# Altium project CW521_BallisticGel.PrjPcb
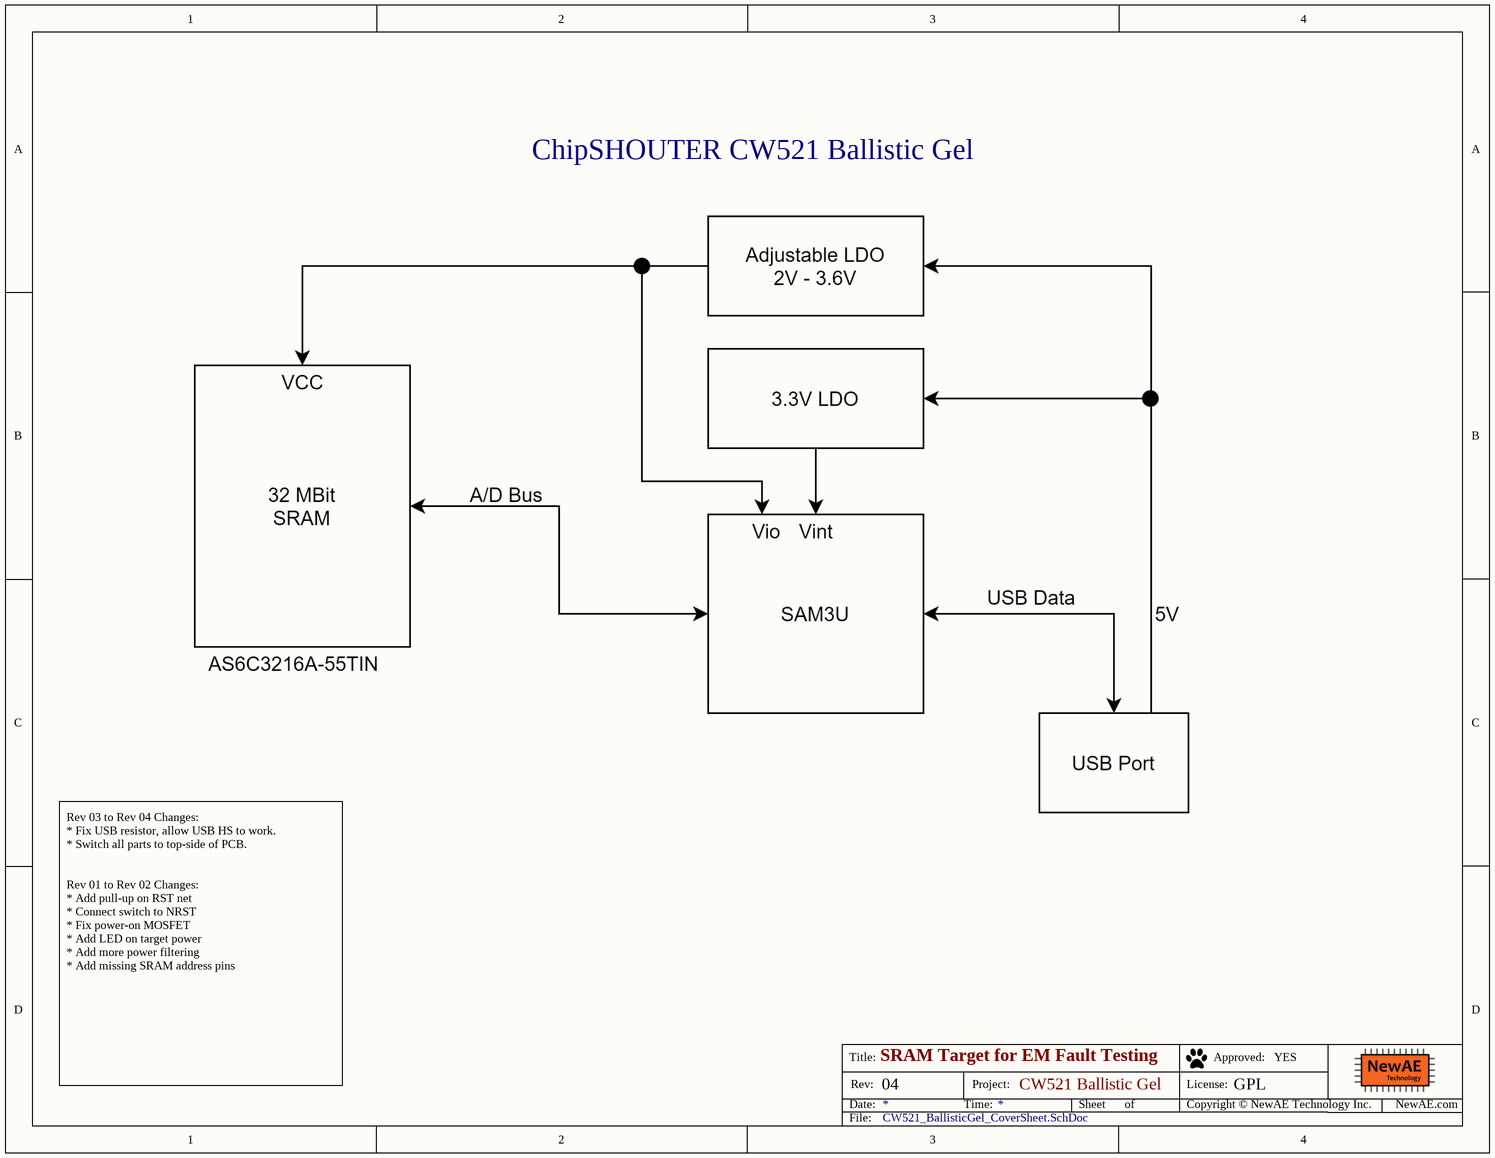
[diagram p0: CW521_BallisticGel_CoverSheet.SchDoc]
PrjLicense: GPL; PrjName: CW521 Ballistic Gel; PrjRev: 04
3 sheets, 102 parts. Net scope: flat (ports and power ports of the same name join across sheets).
Board files: CW521_BallisticGel.PcbDoc, CW521_BallisticGel_PANEL.PcbDoc
Sheets:
  CW521_BallisticGel_CoverSheet.SchDoc
  CW521_BallisticGel_Connectors.SchDoc
  CW521_BallisticGel_Main.SchDoc

## Sheet CW521_BallisticGel_CoverSheet.SchDoc: SRAM Target for EM Fault Testing
size Letter; Organization: NewAE Technology Inc.; Address1: 1083 Queen St., Suite 196; Address2: Halifax; Address3: NS; Address4: Canada B3H 0B2; SheetApproved: YES

### Notes on the sheet
- ChipSHOUTER CW521 Ballistic Gel
- Rev 03 to Rev 04 Changes:
  * Fix USB resistor, allow USB HS to work.
  * Switch all parts to top-side of PCB.
  Rev 01 to Rev 02 Changes:
  * Add pull-up on RST net
  * Connect switch to NRST
  * Fix power-on MOSFET
  * Add LED on target power
  * Add more power filtering
  * Add missing SRAM address pins
- Title:
- Date:
- Rev:
- Time:
- Project:
- Sheet
- of
- License:
- Copyright © NewAE Technology Inc.
- Approved:
- NewAE.com
- File:

## Sheet CW521_BallisticGel_Connectors.SchDoc: SRAM Target for EM Fault Testing
size Letter; Organization: NewAE Technology Inc.; Address1: 1083 Queen St., Suite 196; Address2: Halifax; Address3: NS; Address4: Canada B3H 0B2; SheetApproved: YES
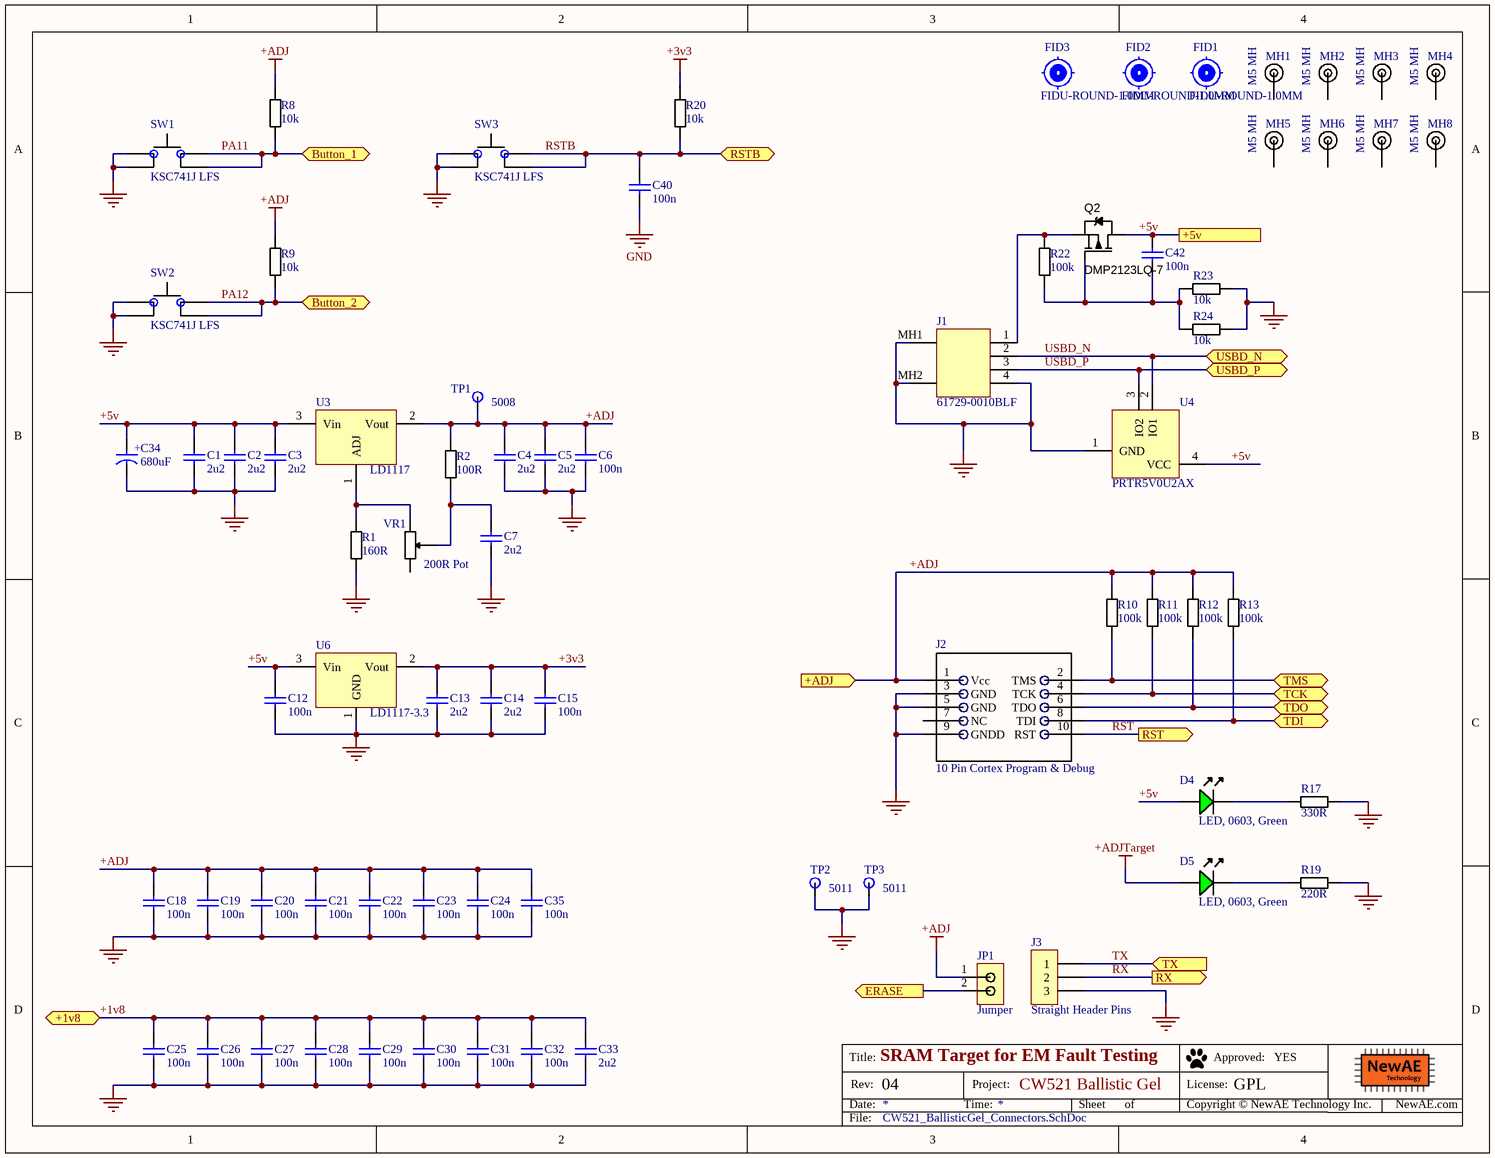
[diagram p1: CW521_BallisticGel_Connectors.SchDoc]

### Parts
C1  2u2  [CAPC0603_M]
C2  2u2  [CAPC0603_M]
C3  2u2  [CAPC0603_M]
C4  2u2  [CAPC0603_M]
C5  2u2  [CAPC0603_M]
C6  100n  [CAPC0603_M]
C7  2u2  [CAPC0603_M]
C12  100n  [CAPC0603_M]
C13  2u2  [CAPC0603_M]
C14  2u2  [CAPC0603_M]
C15  100n  [CAPC0603_M]
C18  100n  [CAPC0603_M]
C19  100n  [CAPC0603_M]
C20  100n  [CAPC0603_M]
C21  100n  [CAPC0603_M]
C22  100n  [CAPC0603_M]
C23  100n  [CAPC0603_M]
C24  100n  [CAPC0603_M]
C25  100n  [CAPC0603_M]
C26  100n  [CAPC0603_M]
C27  100n  [CAPC0603_M]
C28  100n  [CAPC0603_M]
C29  100n  [CAPC0603_M]
C30  100n  [CAPC0603_M]
C31  100n  [CAPC0603_M]
C32  100n  [CAPC0603_M]
C33  2u2  [CAPC0603_M]
C34  680uF  [Cap_16v_680uF]
C35  100n  [CAPC0603_M]
C40  100n  [CAPC0603_M]
C42  100n  [CAPC0603_M]
D4  LED, 0603, Green  [LED-0603-GREEN]
D5  LED, 0603, Green  [LED-0603-GREEN]
FID1  FIDU-ROUND-1.0MM  [FIDU-ROUND-1.0mm]  (no BOM)
FID2  FIDU-ROUND-1.0MM  [FIDU-ROUND-1.0mm]  (no BOM)
FID3  FIDU-ROUND-1.0MM  [FIDU-ROUND-1.0mm]  (no BOM)
J1  61729-0010BLF  [FCI-61729-0010BLF-6_V]
J2  10 Pin Cortex Program & Debug  [0.5mm_SMD_Header_5x2]
J3  Straight Header Pins  [1x3_Straight_pins]
JP1  Jumper  [2x2.54mm_Header]
MH1  M5 MH  [M5_MOUNTING_HOLE]
MH2  M5 MH  [M5_MOUNTING_HOLE]
MH3  M5 MH  [M5_MOUNTING_HOLE]
MH4  M5 MH  [M5_MOUNTING_HOLE]
MH5  M5 MH  [M5_MOUNTING_HOLE]
MH6  M5 MH  [M5_MOUNTING_HOLE]
MH7  M5 MH  [M5_MOUNTING_HOLE]
MH8  M5 MH  [M5_MOUNTING_HOLE]
Q2  DMP2123LQ-7  [SOT95P245X110-3M]
R1  160R  [RESC1608X55N]
R2  100R  [RESC1608X55N]
R8  10k  [RESC1608X55N]
R9  10k  [RESC1608X55N]
R10  100k  [RESC1608X55N]
R11  100k  [RESC1608X55N]
R12  100k  [RESC1608X55N]
R13  100k  [RESC1608X55N]
R17  330R  [RESC1608X55N]
R19  220R  [RESC1608X55N]
R20  10k  [RESC1608X55N]
R22  100k  [RESC1608X55N]
R23  10k  [RESC1608X55N]
R24  10k  [RESC1608X55N]
SW1  KSC741J LFS  [CK_KSC7J]
SW2  KSC741J LFS  [CK_KSC7J]
SW3  KSC741J LFS  [CK_KSC7J]
TP1  5008  [KEYSTONE5008]
TP2  5011  [KEYSTONE5011]
TP3  5011  [KEYSTONE5011]
U3  LD1117  [SOT-223]
U4  PRTR5V0U2AX  [SOT143B]
U6  LD1117-3.3  [SOT-223]
VR1  200R Pot  [Pot_TH_upright_3lead]

### Ports
+1v8 (bidir), +5v, +ADJ (in), Button_1 (bidir), Button_2 (bidir), ERASE (out), RST (out), RSTB (bidir), RX (out), TCK (bidir), TDI (bidir), TDO (bidir), TMS (bidir), TX (in), USBD_N (bidir), USBD_P (bidir)

### Nets
+3v3: C13.1 C14.1 C15.1 R20.1 U6.2(Vout)
+ADJ: C4.1 C5.1 C6.1 C18.1 C19.1 C20.1 C21.1 C22.1 C23.1 C24.1 C35.1 J2.1(Vcc) JP1.1 R2.1 R8.1 R9.1 R10.1 R11.1 R12.1 R13.1 TP1.1 U3.2(Vout) ; port +ADJ
+ADJTarget: D5.A
GND: C1.2 C2.2 C3.2 C4.2 C5.2 C6.2 C7.2 C12.2 C13.2 C14.2 C15.2 C18.2 C19.2 C20.2 C21.2 C22.2 C23.2 C24.2 C25.2 C26.2 C27.2 C28.2 C29.2 C30.2 C31.2 C32.2 C33.2 C34.2 C35.2 C40.2 J1.4 J1.MH1 J1.MH2 J2.3(GND) J2.5(GND) J2.9(GNDD) J3.3 R1.2 R17.2 R19.2 R23.2 R24.2 SW1.1(IN) SW1.4(IN) SW2.1(IN) SW2.4(IN) SW3.1(IN) SW3.4(IN) TP2.1 TP3.1 U4.1(GND) U6.1(GND)
+1v8: C25.1 C26.1 C27.1 C28.1 C29.1 C30.1 C31.1 C32.1 C33.1 ; port +1v8
+5v: C1.1 C2.1 C3.1 C12.1 C34.1 C42.1 D4.A Q2.3(D) U3.3(Vin) U4.4(VCC) U6.3(Vin) ; port +5v
ERASE: JP1.2 ; port ERASE
PA11: R8.2 SW1.2(IN) SW1.3(IN) ; port Button_1
PA12: R9.2 SW2.2(IN) SW2.3(IN) ; port Button_2
RST: J2.10(RST) ; port RST
RSTB: C40.1 R20.2 SW3.2(IN) SW3.3(IN) ; port RSTB
RX: J3.2 ; port RX
TCK: J2.4(TCK) R11.2 ; port TCK
TDI: J2.8(TDI) R13.2 ; port TDI
TDO: J2.6(TDO) R12.2 ; port TDO
TMS: J2.2(TMS) R10.2 ; port TMS
TX: J3.1 ; port TX
USBD_N: J1.2 U4.2(IO1) ; port USBD_N
USBD_P: J1.3 U4.3(IO2) ; port USBD_P
NetC7_1: C7.1 R2.2 VR1.2
NetC42_2: C42.2 Q2.1(G) R22.2 R23.1 R24.1
NetD4_K: D4.K R17.1
NetD5_K: D5.K R19.1
NetJ1_1: J1.1 Q2.2(S) R22.1
NetR1_1: R1.1 U3.1(ADJ) VR1.1

Not connected (* = marked no-connect by the designer): J2 7(NC); MH1 1; MH2 1; MH3 1; MH4 1; MH5 1; MH6 1; MH7 1; MH8 1; VR1 3

### Notes on the sheet
- Title:
- Date:
- Rev:
- Time:
- Project:
- Sheet
- of
- License:
- Copyright © NewAE Technology Inc.
- Approved:
- NewAE.com
- File:
- (in symbol Cap_16v_680uF) +

### Library data of the parts
C1-C5 C7 C13 C14 C33 = CCHIP-2u2-0603: 2u2, 0603; Manufacture 1: Samsung; Manufacture Part Number 1: CL10B225KP8NNNC; Component Group: Capacitor; Case-EIA: 0603; Case-Metric: 1608; Part Number: CCHIP-2u2-0603; Footprint: 0603; Pin Count: 2; Supplier 1: Digi-Key; Supplier Part Number 1: 1276-1134-2-ND; Value: 2u2; Mounting Technology: SMT; Component Kind: Standard; Component Type: Standard
C6 C12 C15 C18-C32 C35 C40 C42 = CCHIP-100n-0603: 100n, 0603; Manufacture 1: Kemet; Manufacture Part Number 1: C0603C104K5RACTU; Component Group: Capacitor; Case-EIA: 0603; Case-Metric: 1608; Rated Voltage: 50V; Part Number: CCHIP-100n-0603; Footprint: 0603; Pin Count: 2; Supplier 1: Digi-Key; Supplier Part Number 1: 399-5089-2-ND; Value: 100n; Mounting Technology: SMT; Component Kind: Standard; Component Type: Standard
C34 = Cap_16v_680uF: Aluminum electrolytic 680uF, 8x16mm, radial; Component Group: Capacitor; PP Material Stack: 0; Part Number: Cap_16v_680uF; Pin Count: 2; Value: 680uF; Mounting Technology: Through-hole; Component Kind: Standard; Component Type: Standard; PP Rotation: 0
D4 D5 = LEDCHIP_0603_GREEN: Chip LED, Green; Manufacture 1: Kingbright; Manufacture Part Number 1: APT1608CGCK; Component Group: Optical; PP Material Stack: 16; PP Rotation: -90; Part Number: LEDCHIP_0603_GREEN; Pin Count: 2; Supplier 1: Digi-Key; Supplier Part Number 1: 754-1116-1-ND; Mounting Technology: SMT; Component Kind: Standard; Component Type: Standard
FID1-FID3 = FIDU-ROUND-1.0MM: ROUND FIDUCIAL; Component Group: PCB Feature; Part Number: FIDU-ROUND-1.0MM; Pin Count: 0; Component Type: Standard (No BOM)
J1 = CMP-0397-00002-2: Single USB 2.0, B Type, Right Angle Jack, Through Hole, RoHS, Tube; Manufacturer: FCI Electronics; Number of Contacts: 4; Gender: Receptacle; Specifications: USB 2.0; Connector Type: USB-B; ComponentLink1URL: http://portal.fciconnect.com/; DatasheetVersion: Rev. V; PartNumber: 61729-0010BLF; ComponentLink3Description: Package Specification; PackageDescription: 6-Pin, Through Hole, Body 12.2 x 16 mm; Packing: Tube; ComponentLink2Description: Datasheet; Mounting Technology: Through Hole; PackageReference: 61729-0010BLF; ComponentLink1Description: Manufacturer URL; ComponentLink3URL: http://portal.fciconnect.com/Comergent//fci/drawing/61729.pdf; ComponentLink2URL: http://portal.fciconnect.com/Comergent//fci/drawing/61729.pdf; RoHS: TRUE; Supplier 1: Digi-Key; Supplier Part Number 1: 609-1039-ND
J2 = Cortex_Debug_Header_10Pin: 10 Pin Cortex Program & Debug 0.5mm pitch; Manufacture 1: Samtec Inc; Manufacture Part Number 1: FTSH-105-01-L-DV-007-K; Component Group: Connector; PP Material Stack: 0; Part Number: Cortex_Debug_Header_10Pin; Pin Count: 10; Supplier 1: Digi-Key; Supplier Part Number 1: SAM9438-ND; Mounting Technology: SMT; RoHS: Yes; Component Kind: Standard; Component Type: Standard; PP Rotation: 0
J3 = HDR_3PIN: 1x3 Straight pin header; Manufacture 1: Wurth Electronics Inc.; Manufacture Part Number 1: 61300311121; Component Group: Connector; PP Material Stack: 0; Part Number: HDR_3PIN; Pin Count: 3; Supplier 1: Digi-Key; Supplier Part Number 1: 732-5316-ND; Mounting Technology: Through-hole; RoHS: Yes; Component Kind: Standard; Component Type: Standard; PP Rotation: 0
JP1 = 2_PIN_JUMPER: 1x2 2.54mm header, male pins; Manufacture 1: Harwin; Manufacture Part Number 1: M20-9990246; Component Group: PCB Feature; PP Material Stack: 0; Part Number: 2_PIN_JUMPER; Pin Count: 2; Supplier 1: Digi-Key; Supplier Part Number 1: 952-2262-ND; Mounting Technology: Through-hole; RoHS: Yes; Component Kind: Standard; Component Type: Standard; PP Rotation: 0
MH1-MH8 = M5_Mounting_Hole: Machine screw #5 plated mounting hole; Component Group: Mechanical; PP Material Stack: 0; Part Number: M5_Mounting_Hole; Pin Count: 1; Component Kind: Mechanical; Component Type: Mechanical; PP Rotation: 0
Q2 = DMP2123LQ-7: P-Channel, 3A, Logic Level; Manufacture 1: Diodes Inc.; Component Group: MOSFET; Part Number: DMP2123LQ-7; Footprint: SOT23; Manufacture Part Number 1: DMP2123LQ-7; Pin Count: 3; Supplier 1: Digi-Key; Supplier Part Number 1: DMP2123LQ-7DICT-ND; Mounting Technology: SMT; Component Kind: Standard; Component Type: Standard
R1 = RCHIP-160R-0603: 160R res, 0603, 1%, 1/10W; Manufacture 1: Yageo; Manufacture Part Number 1: RC0603FR-07160RL; Component Group: Resistor; Case-EIA: 0603; Case-Metric: 1608; Rated Power: 0.1W; Rated Voltage: 75VDC; Part Number: RCHIP-160R-0603; Footprint: 0603; Pin Count: 2; Supplier 1: Digi-Key; Supplier Part Number 1: 311-160HRCT-ND; Value: 160R; Tolerance: 1%; Mounting Technology: SMT; Temperature Range: -55C to 155C; Component Kind: Standard; Component Type: Standard
R2 = RCHIP-100R-0603: 100R res, 0603, 1%, 1/10W; Manufacture 1: Yageo; Manufacture Part Number 1: RC0603FR-07100RL; Component Group: Resistor; Case-EIA: 0603; Case-Metric: 1608; Rated Power: 0.1W; Rated Voltage: 75VDC; Part Number: RCHIP-100R-0603; Footprint: 0603; Pin Count: 2; Supplier 1: Digi-Key; Supplier Part Number 1: 311-100HRCT-ND; Value: 100R; Tolerance: 1%; Mounting Technology: SMT; Temperature Range: -55C to 155C; Component Kind: Standard; Component Type: Standard
R8 R9 R20 R23 R24 = RCHIP-10K-0603: 10k res, 0603, 1%, 1/10W; Manufacture 1: Yageo; Manufacture Part Number 1: RC0603FR-0710KL; Component Group: Resistor; Case-EIA: 0603; Case-Metric: 1608; Rated Power: 0.1W; Rated Voltage: 75VDC; Part Number: RCHIP-10K-0603; Footprint: 0603; Pin Count: 2; Supplier 1: Digi-Key; Supplier Part Number 1: 311-10.0KHRCT-ND; Value: 10k; Tolerance: 1%; Mounting Technology: SMT; Temperature Range: -55C to 155C; Component Kind: Standard; Component Type: Standard
R10-R13 R22 = RCHIP-100K-0603: 100k res, 0603, 1%, 1/10W; Manufacture 1: Yageo; Manufacture Part Number 1: RC0603FR-07100KL; Component Group: Resistor; Case-EIA: 0603; Case-Metric: 1608; Rated Power: 0.1W; Rated Voltage: 75VDC; Part Number: RCHIP-100K-0603; Footprint: 0603; Pin Count: 2; Supplier 1: Digi-Key; Supplier Part Number 1: 311-100KHRCT-ND; Value: 100k; Tolerance: 1%; Mounting Technology: SMT; Temperature Range: -55C to 155C; Component Kind: Standard; Component Type: Standard
R17 = RCHIP-330R-0603: 330R res, 0603, 1%, 1/10W; Manufacture 1: Yageo; Manufacture Part Number 1: RC0603FR-07330RL; Component Group: Resistor; Case-EIA: 0603; Case-Metric: 1608; Rated Power: 0.1W; Rated Voltage: 75VDC; Part Number: RCHIP-330R-0603; Footprint: 0603; Pin Count: 2; Supplier 1: Digi-Key; Supplier Part Number 1: 311-330HRCT-ND; Value: 330R; Tolerance: 1%; Mounting Technology: SMT; Temperature Range: -55C to 155C; Component Kind: Standard; Component Type: Standard
R19 = RCHIP-220R-0603: 220R res, 0603, 1%, 1/10W; Manufacture 1: Yageo; Manufacture Part Number 1: RC0603FR-07220RL; Component Group: Resistor; Case-EIA: 0603; Case-Metric: 1608; Rated Power: 0.1W; Rated Voltage: 75VDC; Part Number: RCHIP-220R-0603; Footprint: 0603; Pin Count: 2; Supplier 1: Digi-Key; Supplier Part Number 1: 311-220HRCT-ND; Value: 220R; Tolerance: 1%; Mounting Technology: SMT; Temperature Range: -55C to 155C; Component Kind: Standard; Component Type: Standard
SW1-SW3 = TACTSW-KSC741J: SWITCH TACTILE SPST-NO 0.01A 32V; Manufacture 1: C&K; PP Material Stack: 0; Part Number: TACTSW-KSC741J; Component Group: Switch; Manufacture Part Number 1: KSC741J LFS; Pin Count: 4; Supplier 1: Digi-Key; Supplier Part Number 1: CKN10309CT-ND; Mounting Technology: SMT; RoHS: Yes; Component Kind: Standard; Component Type: Standard; PP Rotation: 0
TP1 = KEYSTONE_5008: TEST POINT PC COMPACT .063"D ORG; Supplier 1: Digi-Key; Supplier Part Number 1: 36-5008-ND; Part Number: KEYSTONE_5008; Component Group: Test Point; Pin Count: 1; Mounting Technology: Through-hole; Component Kind: Standard; Component Type: Standard
TP2 TP3 = KEYSTONE_5011: TEST POINT PC MULTI PURPOSE BLK; Supplier 1: Digi-Key; Supplier Part Number 1: 36-5011-ND; Part Number: KEYSTONE_5011; Component Group: Test Point; Pin Count: 1; Mounting Technology: Through-hole; Component Kind: Standard; Component Type: Standard
U3 = LD1117SC-R: IC REG LIN POS ADJ 800MA SOT223; Manufacture 1: STMicroelectronics; Component Group: Analog IC; Rated Voltage: 15V; PP Material Stack: 0; Part Number: LD1117SC-R; Manufacture Part Number 1: LD1117SC-R; Pin Count: 3; Supplier 1: Digi-Key; Supplier Part Number 1: 497-4241-1-ND; Mounting Technology: SMT; RoHS: Yes; Component Kind: Standard; Component Type: Standard; PP Rotation: 0
U4 = PRTR5V0U2AX: USB 2.0 high-speed ESD; Component Group: Diode; Supplier 1: Digi-Key; Supplier Part Number 1: 568-7445-1-ND; Part Number: PRTR5V0U2AX; Pin Count: 4; Component Kind: Standard; Component Type: Standard
U6 = LD1117S33: IC REG LIN POS 3.3V 800MA SOT223; Manufacture 1: STMicroelectronics; Manufacture Part Number 1: LD1117S33TR; Manufacture Part Number 2: LT1117CST-3.3#PBF; Manufacture 2: Linear; Component Group: Analog IC; Rated Voltage: 15V; PP Material Stack: 0; Part Number: LD1117S33; Pin Count: 3; Supplier 1: Digi-Key; Supplier Part Number 1: 497-1242-1-ND; Mounting Technology: SMT; RoHS: Yes; Component Kind: Standard; Component Type: Standard; PP Rotation: 0; Supplier 2: Digi-Key; Supplier Part Number 2: LT1117CST-3.3#PBF-ND
VR1 = CT94EW201: 200R, 18 turn, 0.5W; Manufacture 1: Nidec Copal Electronics; Component Group: Resistor; PP Material Stack: 0; Part Number: CT94EW201; Manufacture Part Number 1: CT94EW201; Pin Count: 3; Supplier 1: Digi-Key; Supplier Part Number 1: CT94EW201-ND; Mounting Technology: Through-hole; Component Kind: Standard; Component Type: Standard; PP Rotation: 0

## Sheet CW521_BallisticGel_Main.SchDoc: SRAM Target for EM Fault Testing
size Letter; Organization: NewAE Technology Inc.; Address1: 1083 Queen St., Suite 196; Address2: Halifax; Address3: NS; Address4: Canada B3H 0B2; SheetApproved: YES
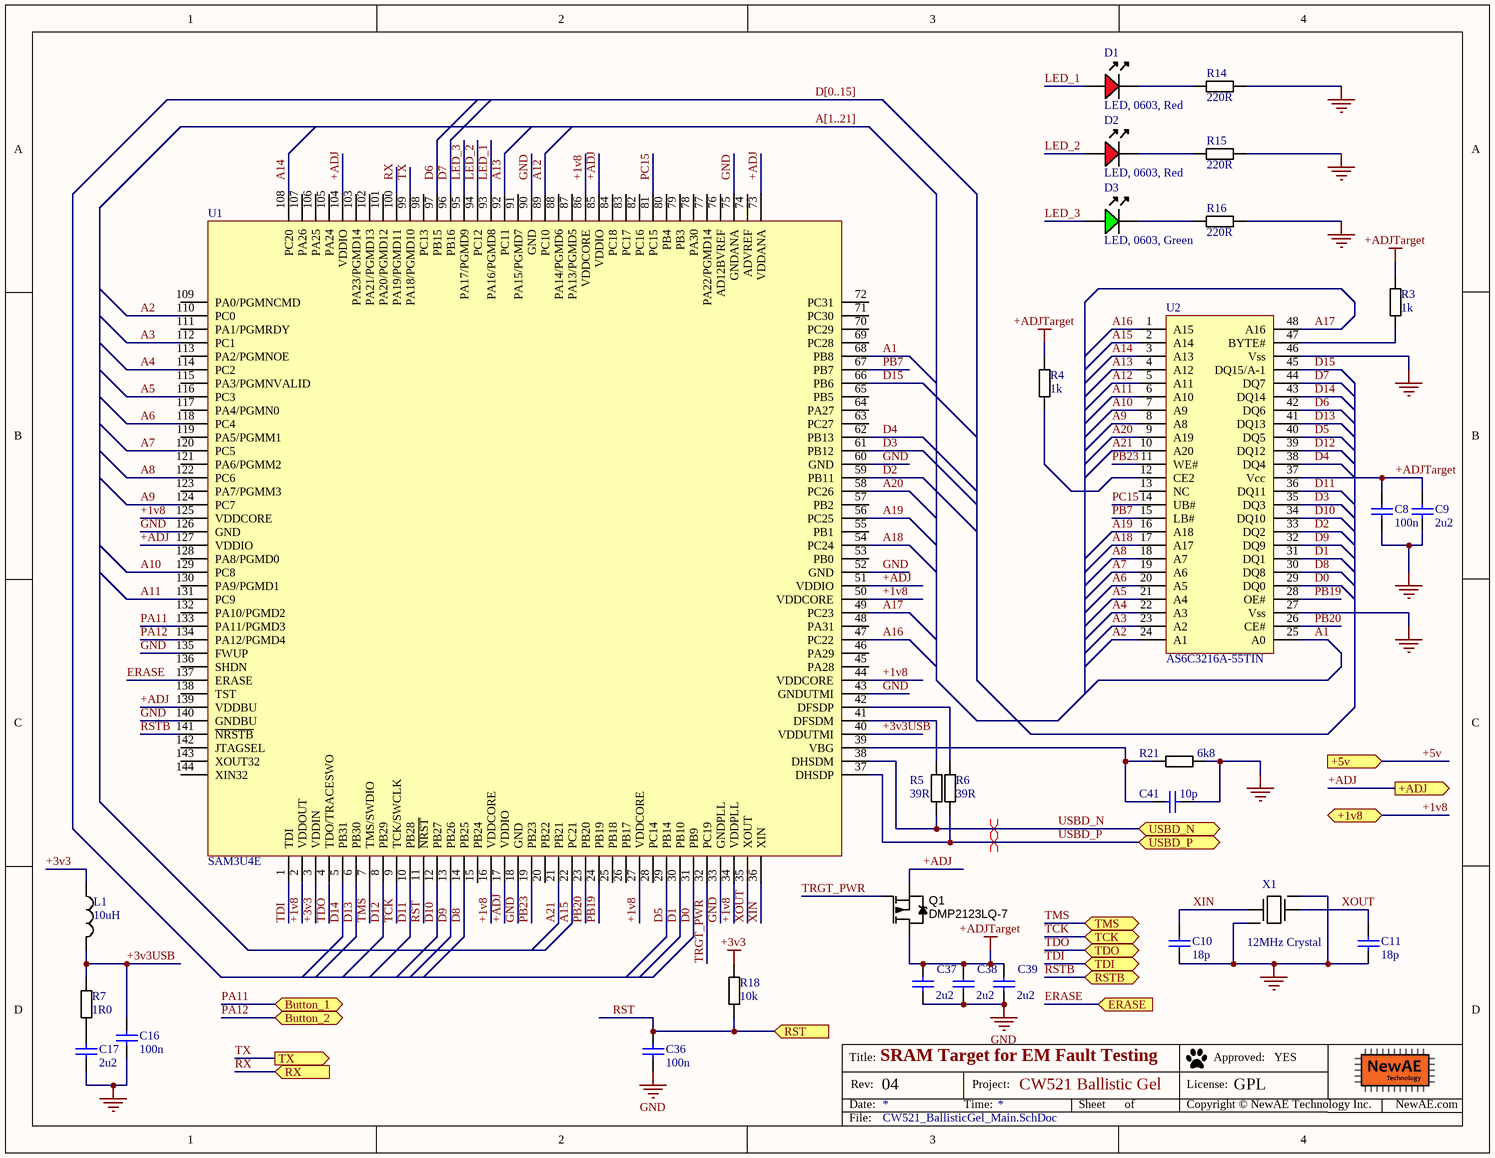
[diagram p2: CW521_BallisticGel_Main.SchDoc]

### Parts
C8  100n  [CAPC0603_M]
C9  2u2  [CAPC0603_M]
C10  18p  [CAPC0402_M]
C11  18p  [CAPC0402_M]
C16  100n  [CAPC0603_M]
C17  2u2  [CAPC0603_M]
C36  100n  [CAPC0603_M]
C37  2u2  [CAPC0603_M]
C38  2u2  [CAPC0603_M]
C39  2u2  [CAPC0603_M]
C41  10p  [CAPC0603_M]
D1  LED, 0603, Red  [LED-0603-RED]
D2  LED, 0603, Red  [LED-0603-RED]
D3  LED, 0603, Green  [LED-0603-GREEN]
L1  10uH  [IND_0603]
Q1  DMP2123LQ-7  [SOT95P245X110-3M]
R3  1k  [RESC1608X55N]
R4  1k  [RESC1608X55N]
R5  39R  [RESC1608X55N]
R6  39R  [RESC1608X55N]
R7  1R0  [RESC1608X55N]
R14  220R  [RESC1608X55N]
R15  220R  [RESC1608X55N]
R16  220R  [RESC1608X55N]
R18  10k  [RESC1608X55N]
R21  6k8  [RESC1608X55N]
U1  SAM3U4E  [LQFP-144_0.5]
U2  AS6C3216A-55TIN  [TSSOP-48_0.5]
X1  12MHz Crystal  [ABM8G]

### Ports
+1v8 (bidir), +5v (in), +ADJ (out), Button_1 (bidir), Button_2 (bidir), ERASE (in), RST (in), RSTB (bidir), RX (in), TCK (bidir), TDI (bidir), TDO (bidir), TMS (bidir), TX (out), USBD_N (bidir), USBD_P (bidir)

### Nets
+3v3: L1.1 R18.1 U1.3(VDDIN)
+ADJ: Q1.2(S) U1.17(VDDIO) U1.51(VDDIO) U1.73(VDDANA) U1.85(VDDIO) U1.104(VDDIO) U1.127(VDDIO) U1.139(VDDBU) ; port +ADJ
+ADJTarget: C8.1 C9.1 C37.1 C38.1 C39.1 Q1.3(D) R3.1 R4.1 U2.37(Vcc)
GND: C8.2 C9.2 C10.2 C11.2 C16.2 C17.2 C36.2 C37.2 C38.2 C39.2 C41.2 R14.2 R15.2 R16.2 R21.2 U1.18(GND) U1.33(GNDPLL) U1.43(GNDUTMI) U1.52(GND) U1.60(GND) U1.75(GNDANA) U1.90(GND) U1.126(GND) U1.135(FWUP) U1.140(GNDBU) U2.27(Vss) U2.46(Vss) X1.2 X1.4
+1v8: U1.2(VDDOUT) U1.16(VDDCORE) U1.27(VDDCORE) U1.34(VDDPLL) U1.44(VDDCORE) U1.50(VDDCORE) U1.86(VDDCORE) U1.125(VDDCORE) ; port +1v8
+3v3USB: C16.1 L1.2 R7.1 U1.40(VDDUTMI)
A1: U1.68(PB8) U2.25(A0)
A2: U1.110(PC0) U2.24(A1)
A3: U1.112(PC1) U2.23(A2)
A4: U1.114(PC2) U2.22(A3)
A5: U1.116(PC3) U2.21(A4)
A6: U1.118(PC4) U2.20(A5)
A7: U1.120(PC5) U2.19(A6)
A8: U1.122(PC6) U2.18(A7)
A9: U1.124(PC7) U2.8(A8)
A10: U1.129(PC8) U2.7(A9)
A11: U1.131(PC9) U2.6(A10)
A12: U1.89(PC10) U2.5(A11)
A13: U1.92(PC11) U2.4(A12)
A14: U1.108(PC20) U2.3(A13)
A15: U1.22(PC21) U2.2(A14)
A16: U1.47(PC22) U2.1(A15)
A17: U1.49(PC23) U2.48(A16)
A18: U1.54(PC24) U2.17(A17)
A19: U1.56(PC25) U2.16(A18)
A20: U1.58(PC26) U2.9(A19)
A21: U1.21(PB21) U2.10(A20)
D0: U1.31(PB9) U2.29(DQ0)
D1: U1.30(PB10) U2.31(DQ1)
D2: U1.59(PB11) U2.33(DQ2)
D3: U1.61(PB12) U2.35(DQ3)
D4: U1.62(PB13) U2.38(DQ4)
D5: U1.29(PB14) U2.40(DQ5)
D6: U1.97(PB15) U2.42(DQ6)
D7: U1.96(PB16) U2.44(DQ7)
D8: U1.14(PB25) U2.30(DQ8)
D9: U1.13(PB26) U2.32(DQ9)
D10: U1.12(PB27) U2.34(DQ10)
D11: U1.10(PB28) U2.36(DQ11)
D12: U1.8(PB29) U2.39(DQ12)
D13: U1.6(PB30) U2.41(DQ13)
D14: U1.5(PB31) U2.43(DQ14)
D15: U1.66(PB6) U2.45(DQ15/A-1)
ERASE: U1.137(ERASE) ; port ERASE
LED_1: D1.A U1.93(PA16/PGMD8)
LED_2: D2.A U1.94(PC12)
LED_3: D3.A U1.95(PA17/PGMD9)
PA11: U1.133(PA11/PGMD3) ; port Button_1
PA12: U1.134(PA12/PGMD4) ; port Button_2
PB7: U1.67(PB7) U2.15(LB#)
PB19: U1.24(PB19) U2.28(OE#)
PB20: U1.23(PB20) U2.26(CE#)
PB23: U1.19(PB23) U2.11(WE#)
PC15: U1.81(PC15) U2.14(UB#)
RST: C36.1 R18.2 U1.11(~{NRST}) ; port RST
RSTB: U1.141(~{NRSTB}) ; port RSTB
RX: U1.100(PA19/PGMD11) ; port RX
TCK: U1.9(TCK/SWCLK) ; port TCK
TDI: U1.1(TDI) ; port TDI
TDO: U1.4(TDO/TRACESWO) ; port TDO
TMS: U1.7(TMS/SWDIO) ; port TMS
TRGT_PWR: Q1.1(G) U1.32(PC19)
TX: U1.99(PA18/PGMD10) ; port TX
USBD_N: R5.2 U1.38(DHSDM) ; port USBD_N
USBD_P: R6.2 U1.37(DHSDP) ; port USBD_P
XIN: C10.1 U1.36(XIN) X1.1
XOUT: C11.1 U1.35(XOUT) X1.3
NetC17_1: C17.1 R7.2
NetC41_1: C41.1 R21.1 U1.39(VBG)
NetD1_K: D1.K R14.1
NetD2_K: D2.K R15.1
NetD3_K: D3.K R16.1
NetR3_2: R3.2 U2.47(BYTE#)
NetR4_2: R4.2 U2.12(CE2)
NetR5_1: R5.1 U1.41(DFSDM)
NetR6_1: R6.1 U1.42(DFSDP)

Not connected (* = marked no-connect by the designer): U1 15(PB24) 20(PB22) 25(PB18) 26(PB17) 28(PC14) 45(PA28) 46(PA29) 48(PA31) 53(PB0) 55(PB1) 57(PB2) 63(PC27) 64(PA27) 65(PB5) 69(PC28) 70(PC29) 71(PC30) 72(PC31) 74(ADVREF) 76(AD12BVREF) 77(PA22/PGMD14) 78(PA30) 79(PB3) 80(PB4) 82(PC16) 83(PC17) 84(PC18) 87(PA13/PGMD5) 88(PA14/PGMD6) 91(PA15/PGMD7) 98(PC13) 101(PA20/PGMD12) 102(PA21/PGMD13) 103(PA23/PGMD14) 105(PA24) 106(PA25) 107(PA26) 109(PA0/PGMNCMD) 111(PA1/PGMRDY) 113(PA2/PGMNOE) 115(PA3/PGMNVALID) 117(PA4/PGMN0) 119(PA5/PGMM1) 121(PA6/PGMM2) 123(PA7/PGMM3) 128(PA8/PGMD0) 130(PA9/PGMD1) 132(PA10/PGMD2) 136(SHDN) 138(TST) 142(JTAGSEL) 143(XOUT32) 144(XIN32); U2 13(NC)

### Buses and harness runs
bus A[1..21]
bus D[0..15]

### Layout directives
differential pair: USBD_N, USBD_P

### Notes on the sheet
- Title:
- Date:
- Rev:
- Time:
- Project:
- Sheet
- of
- License:
- Copyright © NewAE Technology Inc.
- Approved:
- NewAE.com
- File:

### Library data of the parts
C8 C16 C36 = CCHIP-100n-0603: as C6 on sheet CW521_BallisticGel_Connectors; Part Number: CCHIP-100n-0603; Footprint: 0603; Pin Count: 2; Supplier 1: Digi-Key; Supplier Part Number 1: 399-5089-2-ND; Value: 100n; Mounting Technology: SMT; Component Kind: Standard; Component Type: Standard
C9 C17 C37-C39 = CCHIP-2u2-0603: as C1 on sheet CW521_BallisticGel_Connectors; Part Number: CCHIP-2u2-0603; Footprint: 0603; Pin Count: 2; Supplier 1: Digi-Key; Supplier Part Number 1: 1276-1134-2-ND; Value: 2u2; Mounting Technology: SMT; Component Kind: Standard; Component Type: Standard
C10 C11 = CCHIP-18p-0402: 18p, 0402; Manufacture Part Number 1: GRM1555C1H180JA01D; Component Group: Capacitor; Case-EIA: 0402; Part Number: CCHIP-18p-0402; Footprint: 0402; Pin Count: 2; Value: 18p; Mounting Technology: SMT; Component Kind: Standard; Component Type: Standard
C41 = CCHIP-10p-0603: 10p, 0603; Component Group: Capacitor; Case-EIA: 0603; Case-Metric: 1608; Part Number: CCHIP-10p-0603; Footprint: 0603; Pin Count: 2; Value: 10p; Mounting Technology: SMT; Component Kind: Standard; Component Type: Standard
D1 D2 = LEDCHIP_0603_RED: Chip LED, Red; Manufacture 1: Kingbright; Manufacture Part Number 1: APT1608SRCPRV; Component Group: Optical; PP Material Stack: 15; PP Rotation: -90; Part Number: LEDCHIP_0603_RED; Pin Count: 2; Mounting Technology: SMT; Component Kind: Standard; Component Type: Standard; Supplier 1: Digi-Key; Supplier Part Number 1: 754-1122-1-ND
D3 = LEDCHIP_0603_GREEN: as D4 on sheet CW521_BallisticGel_Connectors; Part Number: LEDCHIP_0603_GREEN; Pin Count: 2; Mounting Technology: SMT; Component Kind: Standard; Component Type: Standard; Supplier 1: Digi-Key; Supplier Part Number 1: 754-1116-1-ND
L1 = 10uH_0603: FIXED IND 10UH 300MA 600 MOHM; Manufacture 1: TDK; Manufacture Part Number 1: MLZ1608N100LT000; Component Group: Inductor; PP Material Stack: 0; Part Number: 10uH_0603; Footprint: 0603; Pin Count: 2; Supplier 1: Digi-Key; Supplier Part Number 1: 445-6755-1-ND; Value: 10uH; Mounting Technology: SMT; RoHS: Yes; Component Kind: Standard; Component Type: Standard; PP Rotation: 0
Q1 = DMP2123LQ-7: as Q2 on sheet CW521_BallisticGel_Connectors; Part Number: DMP2123LQ-7; Footprint: SOT23; Manufacture Part Number 1: DMP2123LQ-7; Pin Count: 3; Supplier 1: Digi-Key; Supplier Part Number 1: DMP2123LQ-7DICT-ND; Mounting Technology: SMT; Component Kind: Standard; Component Type: Standard
R3 R4 = RCHIP-1K-0603: 1k res, 0603, 1%, 1/10W; Manufacture 1: Yageo; Manufacture Part Number 1: RC0603FR-071KL; Component Group: Resistor; Case-EIA: 0603; Case-Metric: 1608; Rated Power: 0.1W; Rated Voltage: 75VDC; Part Number: RCHIP-1K-0603; Footprint: 0603; Pin Count: 2; Supplier 1: Digi-Key; Supplier Part Number 1: 311-1.00KHRCT-ND; Value: 1k; Tolerance: 1%; Mounting Technology: SMT; Temperature Range: -55C to 155C; Component Kind: Standard; Component Type: Standard
R5 R6 = RCHIP-39R-0603: 39R res, 0603, 1%, 1/10W; Manufacture 1: Yageo; Manufacture Part Number 1: RC0603FR-0739RL; Component Group: Resistor; Case-EIA: 0603; Case-Metric: 1608; Rated Power: 0.1W; Rated Voltage: 75VDC; Part Number: RCHIP-39R-0603; Footprint: 0603; Pin Count: 2; Supplier 1: Digi-Key; Supplier Part Number 1: 311-39.0HRCT-ND; Value: 39R; Tolerance: 1%; Mounting Technology: SMT; Temperature Range: -55C to 155C; Component Kind: Standard; Component Type: Standard
R7 = RCHIP-1R0-0603: 1R0 res, 0603, 1%, 1/10W; Manufacture 1: Yageo; Manufacture Part Number 1: RC0603FR-071RL; Component Group: Resistor; Case-EIA: 0603; Case-Metric: 1608; Rated Power: 0.1W; Rated Voltage: 75VDC; Part Number: RCHIP-1R0-0603; Footprint: 0603; Pin Count: 2; Supplier 1: Digi-Key; Supplier Part Number 1: 311-1.00HRCT-ND; Value: 1R0; Tolerance: 1%; Mounting Technology: SMT; Temperature Range: -55C to 155C; Component Kind: Standard; Component Type: Standard
R14-R16 = RCHIP-220R-0603: as R19 on sheet CW521_BallisticGel_Connectors; Part Number: RCHIP-220R-0603; Footprint: 0603; Pin Count: 2; Supplier 1: Digi-Key; Supplier Part Number 1: 311-220HRCT-ND; Value: 220R; Tolerance: 1%; Mounting Technology: SMT; Temperature Range: -55C to 155C; Component Kind: Standard; Component Type: Standard
R18 = RCHIP-10K-0603: as R8 on sheet CW521_BallisticGel_Connectors; Part Number: RCHIP-10K-0603; Footprint: 0603; Pin Count: 2; Supplier 1: Digi-Key; Supplier Part Number 1: 311-10.0KHRCT-ND; Value: 10k; Tolerance: 1%; Mounting Technology: SMT; Temperature Range: -55C to 155C; Component Kind: Standard; Component Type: Standard
R21 = RCHIP-6K8-0603: 6k8 res, 0603, 1%, 1/10W; Manufacture 1: Yageo; Manufacture Part Number 1: RC0603FR-076K8L; Component Group: Resistor; Case-EIA: 0603; Case-Metric: 1608; Rated Power: 0.1W; Rated Voltage: 75VDC; Part Number: RCHIP-6K8-0603; Footprint: 0603; Pin Count: 2; Supplier 1: Digi-Key; Supplier Part Number 1: 311-6.80KHRCT-ND; Value: 6k8; Tolerance: 1%; Mounting Technology: SMT; Temperature Range: -55C to 155C; Component Kind: Standard; Component Type: Standard
U1 = SAM3U4E: IC MCU 32BIT 256KB FLASH 144LQFP; Manufacture 1: Microchip; Manufacture Part Number 1: ATSAM3U4EA-AU / ATSAM3U4EA-AU; Component Group: Digital IC; PP Material Stack: 0; Part Number: SAM3U4E; Footprint: LQFP144; Pin Count: 144; Supplier 1: Digi-Key; Supplier Part Number 1: ATSAM3U4EA-AU-ND; Mounting Technology: SMT; RoHS: Yes; Component Kind: Standard; Component Type: Standard; PP Rotation: 0
U2 = AS6C3216: IC SRAM 32MBIT 55NS 48TSSOP; Manufacture 1: Alliance Memory; Component Group: Digital IC; PP Material Stack: 0; Part Number: AS6C3216A; Footprint: TSSOP-48; Manufacture Part Number 1: AS6C3216A-55TIN; Pin Count: 48; Supplier 1: Digi-Key; Mounting Technology: SMT; RoHS: Yes; Component Kind: Standard; Component Type: Standard; PP Rotation: 0
X1 = ABM8G: CRYSTAL 12.0000MHZ 10PF SMD; Manufacture 1: Abracon LLC; Manufacture Part Number 1: ABM8G-12.000MHZ-4Y-T3; PP Material Stack: 0; Part Number: ABM8G; Component Group: Crystal; Pin Count: 4; Supplier 1: Digi-Key; Supplier Part Number 1: 535-10901-1-ND; Mounting Technology: SMT; RoHS: Yes; Component Kind: Standard; Component Type: Standard; PP Rotation: 0

## Nets that join several sheets
+3v3: CW521_BallisticGel_Connectors (5 pins), CW521_BallisticGel_Main (L1.1 R18.1 U1.3)
+ADJ: CW521_BallisticGel_Connectors (22 pins), CW521_BallisticGel_Main (8 pins)
+ADJTarget: CW521_BallisticGel_Connectors (D5.A), CW521_BallisticGel_Main (9 pins)
GND: CW521_BallisticGel_Connectors (52 pins), CW521_BallisticGel_Main (29 pins)
+1v8: CW521_BallisticGel_Connectors (9 pins), CW521_BallisticGel_Main (8 pins)
ERASE: CW521_BallisticGel_Connectors (JP1.2), CW521_BallisticGel_Main (U1.137)
PA11: CW521_BallisticGel_Connectors (R8.2 SW1.2 SW1.3), CW521_BallisticGel_Main (U1.133)
PA12: CW521_BallisticGel_Connectors (R9.2 SW2.2 SW2.3), CW521_BallisticGel_Main (U1.134)
RST: CW521_BallisticGel_Connectors (J2.10), CW521_BallisticGel_Main (C36.1 R18.2 U1.11)
RSTB: CW521_BallisticGel_Connectors (C40.1 R20.2 SW3.2 SW3.3), CW521_BallisticGel_Main (U1.141)
RX: CW521_BallisticGel_Connectors (J3.2), CW521_BallisticGel_Main (U1.100)
TCK: CW521_BallisticGel_Connectors (J2.4 R11.2), CW521_BallisticGel_Main (U1.9)
TDI: CW521_BallisticGel_Connectors (J2.8 R13.2), CW521_BallisticGel_Main (U1.1)
TDO: CW521_BallisticGel_Connectors (J2.6 R12.2), CW521_BallisticGel_Main (U1.4)
TMS: CW521_BallisticGel_Connectors (J2.2 R10.2), CW521_BallisticGel_Main (U1.7)
TX: CW521_BallisticGel_Connectors (J3.1), CW521_BallisticGel_Main (U1.99)
USBD_N: CW521_BallisticGel_Connectors (J1.2 U4.2), CW521_BallisticGel_Main (R5.2 U1.38)
USBD_P: CW521_BallisticGel_Connectors (J1.3 U4.3), CW521_BallisticGel_Main (R6.2 U1.37)